# EasyEDA Pro project 重力怀表.epro, schematic Schematic1
Board Name: Board1; Create Date: 2026-02-02; Page Name: P1; Project Name: 重力怀表; Schematic Name: Schematic1; Update Date: 2026-06-20; Company: 嘉立创EDA; Page Size: A4; Version: V1.0
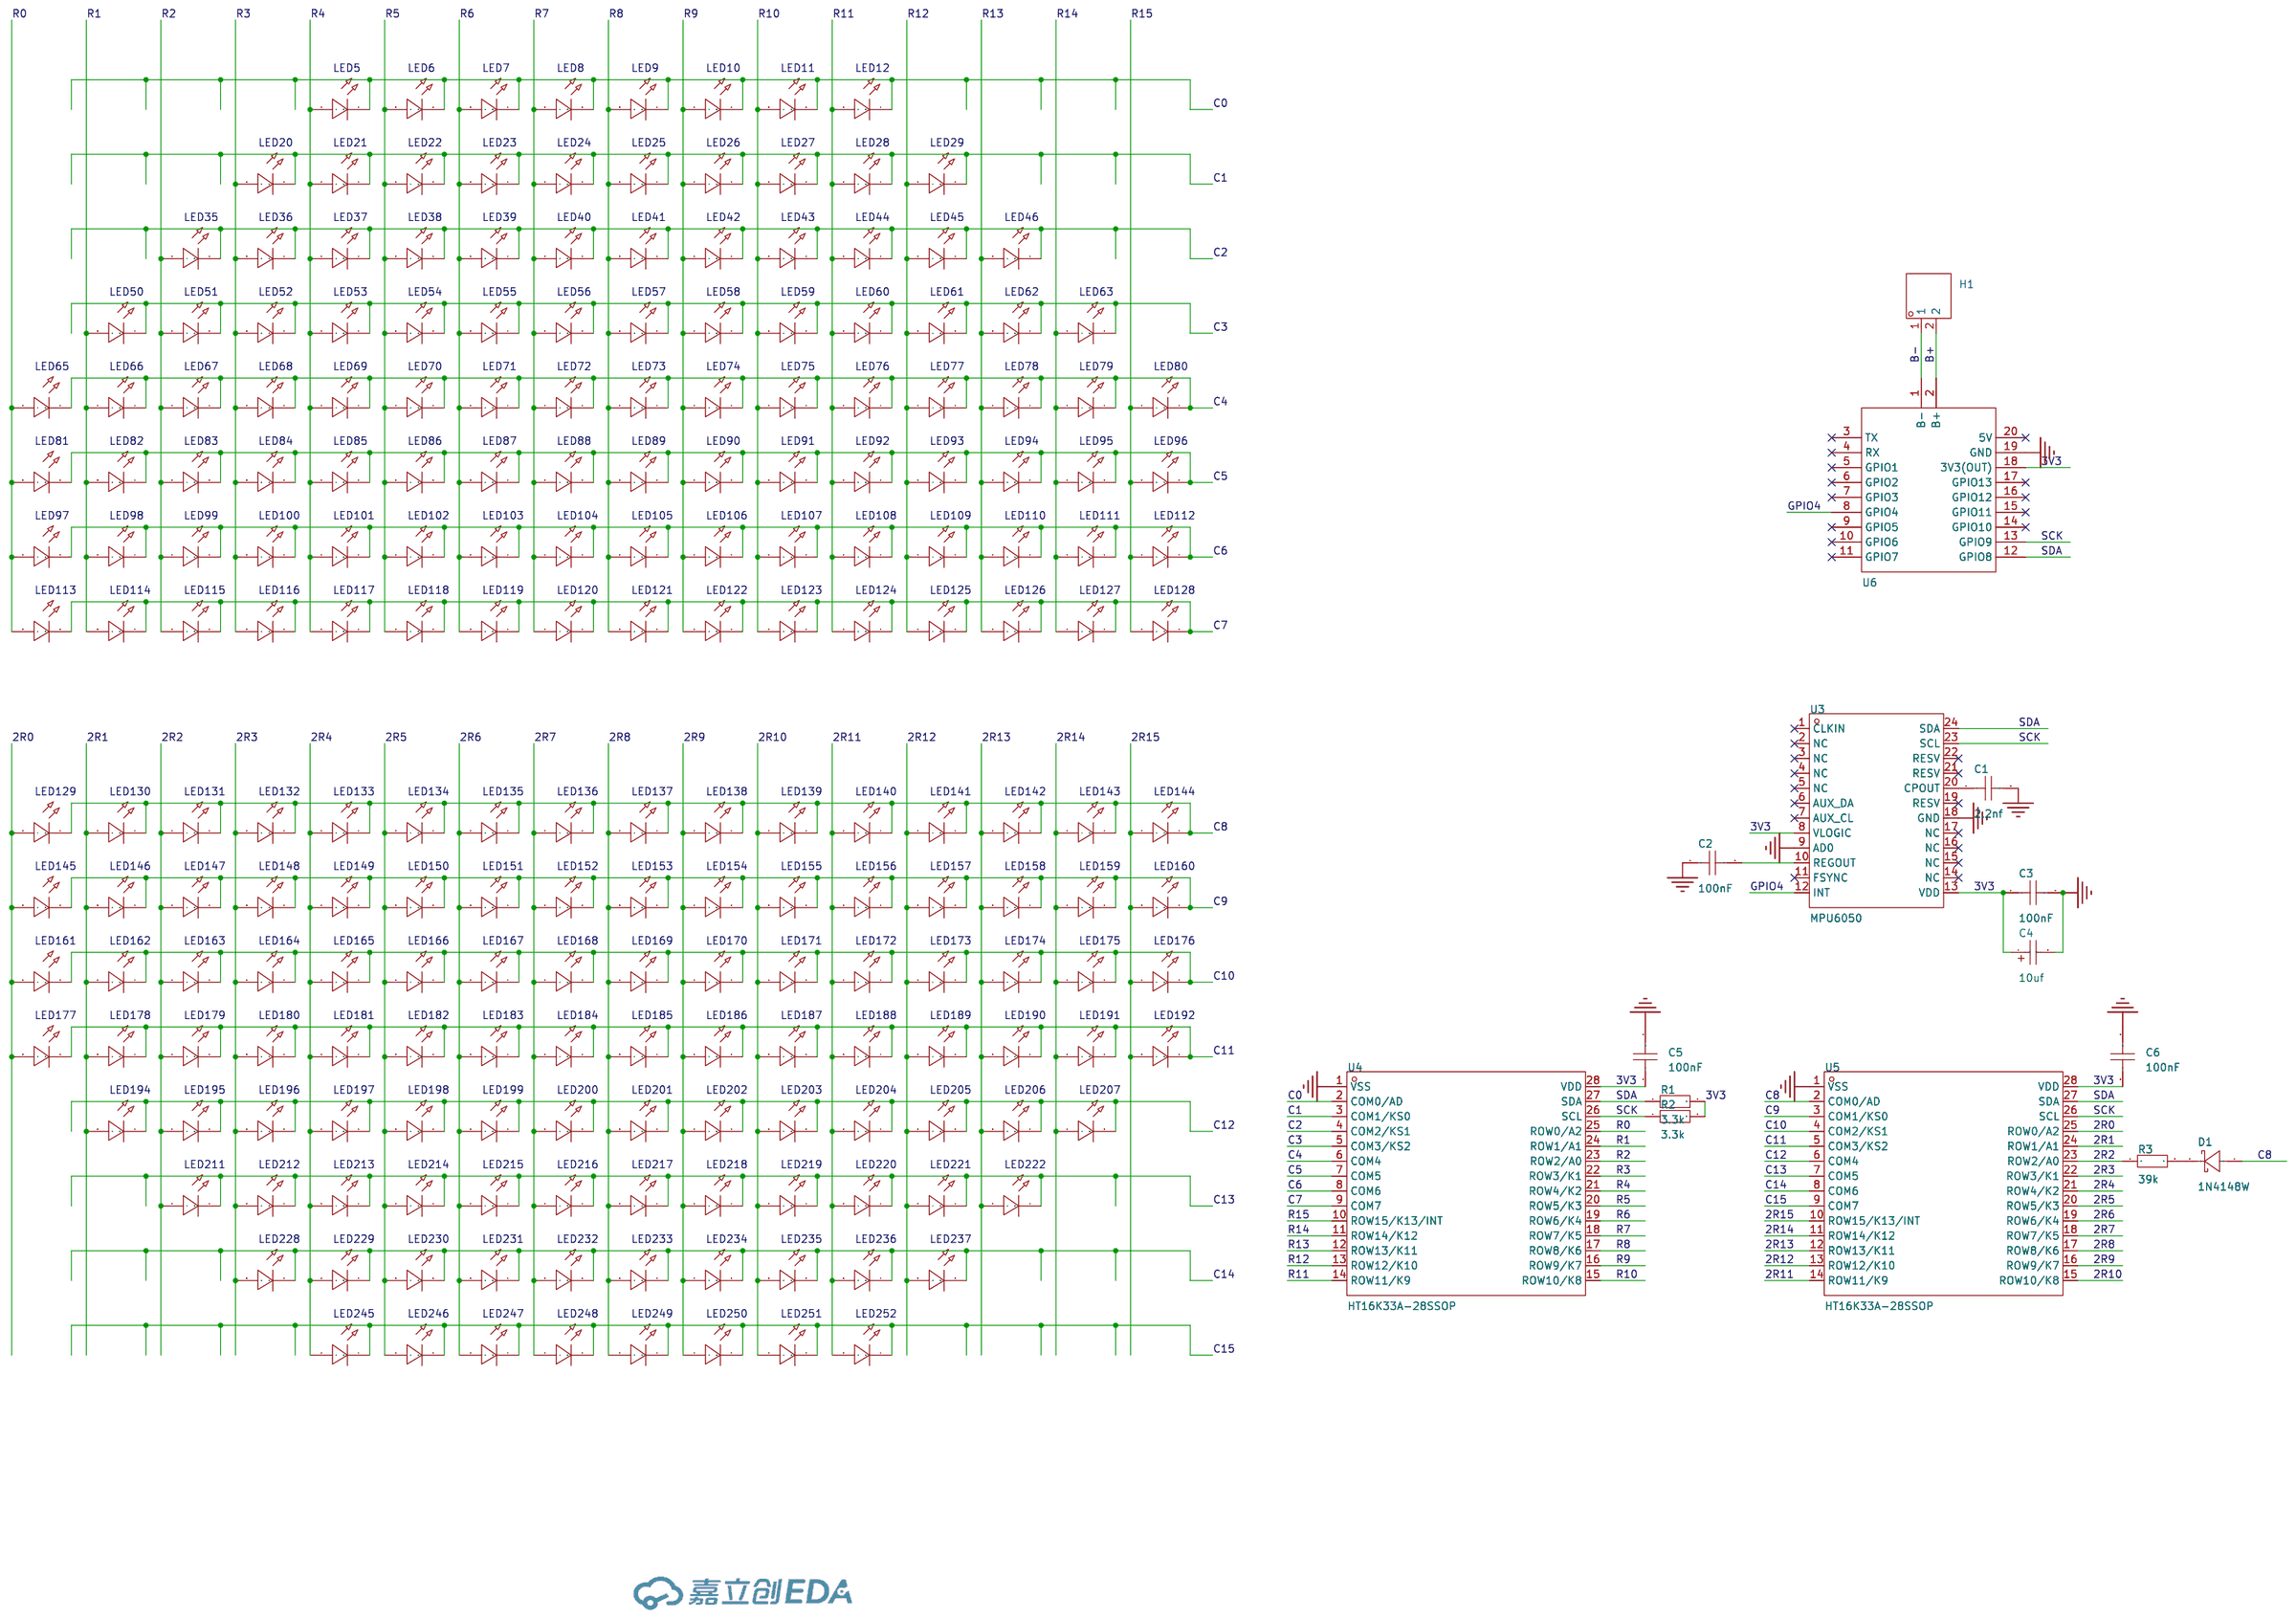
[diagram p0: schematic sheet]

## Parts
C1  2.2nf  [C0603]
C2  100nF  [C0603]
C3  100nF  [C0603]
C4  10uf  [CASE-B_3528]
C5  100nF  [C0603]
C6  100nF  [C0603]
D1  1N4148W  [SOD-123_L2.7-W1.6-LS3.7-FD]
H1  -  [HDR-TH_2P-P2.54-V-M-1]
LED5  -  [LED_0402]
LED6  -  [LED_0402]
LED7  -  [LED_0402]
LED8  -  [LED_0402]
LED9  -  [LED_0402]
LED10  -  [LED_0402]
LED11  -  [LED_0402]
LED12  -  [LED_0402]
LED20  -  [LED_0402]
LED21  -  [LED_0402]
LED22  -  [LED_0402]
LED23  -  [LED_0402]
LED24  -  [LED_0402]
LED25  -  [LED_0402]
LED26  -  [LED_0402]
LED27  -  [LED_0402]
LED28  -  [LED_0402]
LED29  -  [LED_0402]
LED35  -  [LED_0402]
LED36  -  [LED_0402]
LED37  -  [LED_0402]
LED38  -  [LED_0402]
LED39  -  [LED_0402]
LED40  -  [LED_0402]
LED41  -  [LED_0402]
LED42  -  [LED_0402]
LED43  -  [LED_0402]
LED44  -  [LED_0402]
LED45  -  [LED_0402]
LED46  -  [LED_0402]
LED50  -  [LED_0402]
LED51  -  [LED_0402]
LED52  -  [LED_0402]
LED53  -  [LED_0402]
LED54  -  [LED_0402]
LED55  -  [LED_0402]
LED56  -  [LED_0402]
LED57  -  [LED_0402]
LED58  -  [LED_0402]
LED59  -  [LED_0402]
LED60  -  [LED_0402]
LED61  -  [LED_0402]
LED62  -  [LED_0402]
LED63  -  [LED_0402]
LED65  -  [LED_0402]
LED66  -  [LED_0402]
LED67  -  [LED_0402]
LED68  -  [LED_0402]
LED69  -  [LED_0402]
LED70  -  [LED_0402]
LED71  -  [LED_0402]
LED72  -  [LED_0402]
LED73  -  [LED_0402]
LED74  -  [LED_0402]
LED75  -  [LED_0402]
LED76  -  [LED_0402]
LED77  -  [LED_0402]
LED78  -  [LED_0402]
LED79  -  [LED_0402]
LED80  -  [LED_0402]
LED81  -  [LED_0402]
LED82  -  [LED_0402]
LED83  -  [LED_0402]
LED84  -  [LED_0402]
LED85  -  [LED_0402]
LED86  -  [LED_0402]
LED87  -  [LED_0402]
LED88  -  [LED_0402]
LED89  -  [LED_0402]
LED90  -  [LED_0402]
LED91  -  [LED_0402]
LED92  -  [LED_0402]
LED93  -  [LED_0402]
LED94  -  [LED_0402]
LED95  -  [LED_0402]
LED96  -  [LED_0402]
LED97  -  [LED_0402]
LED98  -  [LED_0402]
LED99  -  [LED_0402]
LED100  -  [LED_0402]
LED101  -  [LED_0402]
LED102  -  [LED_0402]
LED103  -  [LED_0402]
LED104  -  [LED_0402]
LED105  -  [LED_0402]
LED106  -  [LED_0402]
LED107  -  [LED_0402]
LED108  -  [LED_0402]
LED109  -  [LED_0402]
LED110  -  [LED_0402]
LED111  -  [LED_0402]
LED112  -  [LED_0402]
LED113  -  [LED_0402]
LED114  -  [LED_0402]
LED115  -  [LED_0402]
LED116  -  [LED_0402]
LED117  -  [LED_0402]
LED118  -  [LED_0402]
LED119  -  [LED_0402]
LED120  -  [LED_0402]
LED121  -  [LED_0402]
LED122  -  [LED_0402]
LED123  -  [LED_0402]
LED124  -  [LED_0402]
LED125  -  [LED_0402]
LED126  -  [LED_0402]
LED127  -  [LED_0402]
LED128  -  [LED_0402]
LED129  -  [LED_0402]
LED130  -  [LED_0402]
LED131  -  [LED_0402]
LED132  -  [LED_0402]
LED133  -  [LED_0402]
LED134  -  [LED_0402]
LED135  -  [LED_0402]
LED136  -  [LED_0402]
LED137  -  [LED_0402]
LED138  -  [LED_0402]
LED139  -  [LED_0402]
LED140  -  [LED_0402]
LED141  -  [LED_0402]
LED142  -  [LED_0402]
LED143  -  [LED_0402]
LED144  -  [LED_0402]
LED145  -  [LED_0402]
LED146  -  [LED_0402]
LED147  -  [LED_0402]
LED148  -  [LED_0402]
LED149  -  [LED_0402]
LED150  -  [LED_0402]
LED151  -  [LED_0402]
LED152  -  [LED_0402]
LED153  -  [LED_0402]
LED154  -  [LED_0402]
LED155  -  [LED_0402]
LED156  -  [LED_0402]
LED157  -  [LED_0402]
LED158  -  [LED_0402]
LED159  -  [LED_0402]
LED160  -  [LED_0402]
LED161  -  [LED_0402]
LED162  -  [LED_0402]
LED163  -  [LED_0402]
LED164  -  [LED_0402]
LED165  -  [LED_0402]
LED166  -  [LED_0402]
LED167  -  [LED_0402]
LED168  -  [LED_0402]
LED169  -  [LED_0402]
LED170  -  [LED_0402]
LED171  -  [LED_0402]
LED172  -  [LED_0402]
LED173  -  [LED_0402]
LED174  -  [LED_0402]
LED175  -  [LED_0402]
LED176  -  [LED_0402]
LED177  -  [LED_0402]
LED178  -  [LED_0402]
LED179  -  [LED_0402]
LED180  -  [LED_0402]
LED181  -  [LED_0402]
LED182  -  [LED_0402]
LED183  -  [LED_0402]
LED184  -  [LED_0402]
LED185  -  [LED_0402]
LED186  -  [LED_0402]
LED187  -  [LED_0402]
LED188  -  [LED_0402]
LED189  -  [LED_0402]
LED190  -  [LED_0402]
LED191  -  [LED_0402]
LED192  -  [LED_0402]
LED194  -  [LED_0402]
LED195  -  [LED_0402]
LED196  -  [LED_0402]
LED197  -  [LED_0402]
LED198  -  [LED_0402]
LED199  -  [LED_0402]
LED200  -  [LED_0402]
LED201  -  [LED_0402]
LED202  -  [LED_0402]
LED203  -  [LED_0402]
LED204  -  [LED_0402]
LED205  -  [LED_0402]
LED206  -  [LED_0402]
LED207  -  [LED_0402]
LED211  -  [LED_0402]
LED212  -  [LED_0402]
LED213  -  [LED_0402]
LED214  -  [LED_0402]
LED215  -  [LED_0402]
LED216  -  [LED_0402]
LED217  -  [LED_0402]
LED218  -  [LED_0402]
LED219  -  [LED_0402]
LED220  -  [LED_0402]
LED221  -  [LED_0402]
LED222  -  [LED_0402]
LED228  -  [LED_0402]
LED229  -  [LED_0402]
LED230  -  [LED_0402]
LED231  -  [LED_0402]
LED232  -  [LED_0402]
LED233  -  [LED_0402]
LED234  -  [LED_0402]
LED235  -  [LED_0402]
LED236  -  [LED_0402]
LED237  -  [LED_0402]
LED245  -  [LED_0402]
LED246  -  [LED_0402]
LED247  -  [LED_0402]
LED248  -  [LED_0402]
LED249  -  [LED_0402]
LED250  -  [LED_0402]
LED251  -  [LED_0402]
LED252  -  [LED_0402]
R1  3.3k  [R0603]
R2  3.3k  [R0603]
R3  39k  [R0603]
U3  MPU6050  [QFN-24_L4.0-W4.0-P0.50-BL]
U4  HT16K33A-28SSOP  [SSOP-28_L9.9-W3.9-P0.64-LS6.0-BL]
U5  HT16K33A-28SSOP  [SSOP-28_L9.9-W3.9-P0.64-LS6.0-BL]
U6  -  [esp32 suoermini s3]

## Library data of the parts
C1-C3 C5 C6 = CAP_0603: Supplier Footprint: 0603
C4 = TAJB107K006RNJ: 容值:100uF;精度:±10%;额定电压:6.3V;等效串联电阻(ESR):1.7Ω@100kHz;; LCSC Part Name: 100uF ±10% 6.3V; Supplier Part: C16133; Manufacturer: Kyocera AVX; Supplier Footprint: CASE-B-3528-21(mm); JLCPCB Part Class: 基础库; Supplier: LCSC; Tolerance: ±10%; Voltage Rating: 6.3V; Equivalent Series Resistance(ESR): 1.7Ω@100kHz; Operating Temperature: -55℃~+125℃
D1 = 1N4148W_C7420318: 二极管配置:独立式;正向压降(Vf):1.25V@150mA;直流反向耐压(Vr):100V;整流电流:150mA;反向恢复时间(Trr):4ns;; LCSC Part Name: 100V 150mA; Supplier Part: C7420318; Manufacturer: R+O(宏嘉诚); Supplier Footprint: SOD-123; JLCPCB Part Class: 扩展库; Datasheet: https://item.szlcsc.com/datasheet/1N4148W/8397140.html; Supplier: LCSC; Diode Configuration: 独立式; Voltage - Forward(Vf@If): 1.25V@150mA; Voltage - DC Reverse(Vr): 100V; Current - Rectified: 150mA; Pd - Power Dissipation: 400mW; Reverse Leakage Current (Ir): 1uA@75V; Reverse Recovery Time (trr): 4ns; Operating Junction Temperature Range: -55℃~+150℃; Non-Repetitive Peak Forward Surge Current: 2A
H1 = HDR-M_2.54_1x2P: Supplier Part: C124375; Supplier Footprint: 插件
LED5-LED12 LED20-LED29 LED35-LED46 LED50-LED63 LED65-LED192 LED194-LED207 LED211-LED222 LED228-LED237 LED245-LED252 = LED_0402-G: Supplier Footprint: 0402
R1-R3 = Res_0603: Supplier Footprint: 0603
U3 = MPU6050: Supplier Part: C9900042518; Supplier Footprint: QFN-24_L4.0-W4.0-P0.50-BL-EP2.7; Supplier: LCSC
U4 U5 = HT16K33A-28SSOP: Supplier Part: C5444738; Manufacturer: HOLTEK(合泰/盛群); Supplier Footprint: SSOP-28; JLCPCB Part Class: 扩展库; Datasheet: https://atta.szlcsc.com/upload/public/pdf/source/20230511/B2CD5F3AD41502590BB636DD50A0336A.pdf; Supplier: LCSC
U6 = esp32 supermini s3

## Nets
3V3: C3.1 C4.1 C5.1 C6.1 R1.2 R2.2 U3.8(VLOGIC) U3.13(VDD) U4.28(VDD) U5.28(VDD) U6.18(3V3(OUT))
GND: C1.2 C2.1 C3.2 C4.2 C5.2 C6.2 U3.9(AD0) U3.18(GND) U4.1(VSS) U5.1(VSS) U6.19(GND)
2R0: LED129.2(A) LED145.2(A) LED161.2(A) LED177.2(A) U5.25(ROW0/A2)
2R1: LED130.2(A) LED146.2(A) LED162.2(A) LED178.2(A) LED194.2(A) U5.24(ROW1/A1)
2R2: LED131.2(A) LED147.2(A) LED163.2(A) LED179.2(A) LED195.2(A) LED211.2(A) R3.1 U5.23(ROW2/A0)
2R3: LED132.2(A) LED148.2(A) LED164.2(A) LED180.2(A) LED196.2(A) LED212.2(A) LED228.2(A) U5.22(ROW3/K1)
2R4: LED133.2(A) LED149.2(A) LED165.2(A) LED181.2(A) LED197.2(A) LED213.2(A) LED229.2(A) LED245.2(A) U5.21(ROW4/K2)
2R5: LED134.2(A) LED150.2(A) LED166.2(A) LED182.2(A) LED198.2(A) LED214.2(A) LED230.2(A) LED246.2(A) U5.20(ROW5/K3)
2R6: LED135.2(A) LED151.2(A) LED167.2(A) LED183.2(A) LED199.2(A) LED215.2(A) LED231.2(A) LED247.2(A) U5.19(ROW6/K4)
2R7: LED136.2(A) LED152.2(A) LED168.2(A) LED184.2(A) LED200.2(A) LED216.2(A) LED232.2(A) LED248.2(A) U5.18(ROW7/K5)
2R8: LED137.2(A) LED153.2(A) LED169.2(A) LED185.2(A) LED201.2(A) LED217.2(A) LED233.2(A) LED249.2(A) U5.17(ROW8/K6)
2R9: LED138.2(A) LED154.2(A) LED170.2(A) LED186.2(A) LED202.2(A) LED218.2(A) LED234.2(A) LED250.2(A) U5.16(ROW9/K7)
2R10: LED139.2(A) LED155.2(A) LED171.2(A) LED187.2(A) LED203.2(A) LED219.2(A) LED235.2(A) LED251.2(A) U5.15(ROW10/K8)
2R11: LED140.2(A) LED156.2(A) LED172.2(A) LED188.2(A) LED204.2(A) LED220.2(A) LED236.2(A) LED252.2(A) U5.14(ROW11/K9)
2R12: LED141.2(A) LED157.2(A) LED173.2(A) LED189.2(A) LED205.2(A) LED221.2(A) LED237.2(A) U5.13(ROW12/K10)
2R13: LED142.2(A) LED158.2(A) LED174.2(A) LED190.2(A) LED206.2(A) LED222.2(A) U5.12(ROW13/K11)
2R14: LED143.2(A) LED159.2(A) LED175.2(A) LED191.2(A) LED207.2(A) U5.11(ROW14/K12)
2R15: LED144.2(A) LED160.2(A) LED176.2(A) LED192.2(A) U5.10(ROW15/K13/INT)
B+: H1.2 U6.2(B+)
B-: H1.1 U6.1(B-)
C0: LED5.1(C) LED6.1(C) LED7.1(C) LED8.1(C) LED9.1(C) LED10.1(C) LED11.1(C) LED12.1(C) U4.2(COM0/AD)
C1: LED20.1(C) LED21.1(C) LED22.1(C) LED23.1(C) LED24.1(C) LED25.1(C) LED26.1(C) LED27.1(C) LED28.1(C) LED29.1(C) U4.3(COM1/KS0)
C2: LED35.1(C) LED36.1(C) LED37.1(C) LED38.1(C) LED39.1(C) LED40.1(C) LED41.1(C) LED42.1(C) LED43.1(C) LED44.1(C) LED45.1(C) LED46.1(C) U4.4(COM2/KS1)
C3: LED50.1(C) LED51.1(C) LED52.1(C) LED53.1(C) LED54.1(C) LED55.1(C) LED56.1(C) LED57.1(C) LED58.1(C) LED59.1(C) LED60.1(C) LED61.1(C) LED62.1(C) LED63.1(C) U4.5(COM3/KS2)
C4: LED65.1(C) LED66.1(C) LED67.1(C) LED68.1(C) LED69.1(C) LED70.1(C) LED71.1(C) LED72.1(C) LED73.1(C) LED74.1(C) LED75.1(C) LED76.1(C) LED77.1(C) LED78.1(C) LED79.1(C) LED80.1(C) U4.6(COM4)
C5: LED81.1(C) LED82.1(C) LED83.1(C) LED84.1(C) LED85.1(C) LED86.1(C) LED87.1(C) LED88.1(C) LED89.1(C) LED90.1(C) LED91.1(C) LED92.1(C) LED93.1(C) LED94.1(C) LED95.1(C) LED96.1(C) U4.7(COM5)
C6: LED97.1(C) LED98.1(C) LED99.1(C) LED100.1(C) LED101.1(C) LED102.1(C) LED103.1(C) LED104.1(C) LED105.1(C) LED106.1(C) LED107.1(C) LED108.1(C) LED109.1(C) LED110.1(C) LED111.1(C) LED112.1(C) U4.8(COM6)
C7: LED113.1(C) LED114.1(C) LED115.1(C) LED116.1(C) LED117.1(C) LED118.1(C) LED119.1(C) LED120.1(C) LED121.1(C) LED122.1(C) LED123.1(C) LED124.1(C) LED125.1(C) LED126.1(C) LED127.1(C) LED128.1(C) U4.9(COM7)
C8: D1.1(A) LED129.1(C) LED130.1(C) LED131.1(C) LED132.1(C) LED133.1(C) LED134.1(C) LED135.1(C) LED136.1(C) LED137.1(C) LED138.1(C) LED139.1(C) LED140.1(C) LED141.1(C) LED142.1(C) LED143.1(C) LED144.1(C) U5.2(COM0/AD)
C9: LED145.1(C) LED146.1(C) LED147.1(C) LED148.1(C) LED149.1(C) LED150.1(C) LED151.1(C) LED152.1(C) LED153.1(C) LED154.1(C) LED155.1(C) LED156.1(C) LED157.1(C) LED158.1(C) LED159.1(C) LED160.1(C) U5.3(COM1/KS0)
C10: LED161.1(C) LED162.1(C) LED163.1(C) LED164.1(C) LED165.1(C) LED166.1(C) LED167.1(C) LED168.1(C) LED169.1(C) LED170.1(C) LED171.1(C) LED172.1(C) LED173.1(C) LED174.1(C) LED175.1(C) LED176.1(C) U5.4(COM2/KS1)
C11: LED177.1(C) LED178.1(C) LED179.1(C) LED180.1(C) LED181.1(C) LED182.1(C) LED183.1(C) LED184.1(C) LED185.1(C) LED186.1(C) LED187.1(C) LED188.1(C) LED189.1(C) LED190.1(C) LED191.1(C) LED192.1(C) U5.5(COM3/KS2)
C12: LED194.1(C) LED195.1(C) LED196.1(C) LED197.1(C) LED198.1(C) LED199.1(C) LED200.1(C) LED201.1(C) LED202.1(C) LED203.1(C) LED204.1(C) LED205.1(C) LED206.1(C) LED207.1(C) U5.6(COM4)
C13: LED211.1(C) LED212.1(C) LED213.1(C) LED214.1(C) LED215.1(C) LED216.1(C) LED217.1(C) LED218.1(C) LED219.1(C) LED220.1(C) LED221.1(C) LED222.1(C) U5.7(COM5)
C14: LED228.1(C) LED229.1(C) LED230.1(C) LED231.1(C) LED232.1(C) LED233.1(C) LED234.1(C) LED235.1(C) LED236.1(C) LED237.1(C) U5.8(COM6)
C15: LED245.1(C) LED246.1(C) LED247.1(C) LED248.1(C) LED249.1(C) LED250.1(C) LED251.1(C) LED252.1(C) U5.9(COM7)
GPIO4: U3.12(INT) U6.8(GPIO4)
R0: LED65.2(A) LED81.2(A) LED97.2(A) LED113.2(A) U4.25(ROW0/A2)
R1: LED50.2(A) LED66.2(A) LED82.2(A) LED98.2(A) LED114.2(A) U4.24(ROW1/A1)
R2: LED35.2(A) LED51.2(A) LED67.2(A) LED83.2(A) LED99.2(A) LED115.2(A) U4.23(ROW2/A0)
R3: LED20.2(A) LED36.2(A) LED52.2(A) LED68.2(A) LED84.2(A) LED100.2(A) LED116.2(A) U4.22(ROW3/K1)
R4: LED5.2(A) LED21.2(A) LED37.2(A) LED53.2(A) LED69.2(A) LED85.2(A) LED101.2(A) LED117.2(A) U4.21(ROW4/K2)
R5: LED6.2(A) LED22.2(A) LED38.2(A) LED54.2(A) LED70.2(A) LED86.2(A) LED102.2(A) LED118.2(A) U4.20(ROW5/K3)
R6: LED7.2(A) LED23.2(A) LED39.2(A) LED55.2(A) LED71.2(A) LED87.2(A) LED103.2(A) LED119.2(A) U4.19(ROW6/K4)
R7: LED8.2(A) LED24.2(A) LED40.2(A) LED56.2(A) LED72.2(A) LED88.2(A) LED104.2(A) LED120.2(A) U4.18(ROW7/K5)
R8: LED9.2(A) LED25.2(A) LED41.2(A) LED57.2(A) LED73.2(A) LED89.2(A) LED105.2(A) LED121.2(A) U4.17(ROW8/K6)
R9: LED10.2(A) LED26.2(A) LED42.2(A) LED58.2(A) LED74.2(A) LED90.2(A) LED106.2(A) LED122.2(A) U4.16(ROW9/K7)
R10: LED11.2(A) LED27.2(A) LED43.2(A) LED59.2(A) LED75.2(A) LED91.2(A) LED107.2(A) LED123.2(A) U4.15(ROW10/K8)
R11: LED12.2(A) LED28.2(A) LED44.2(A) LED60.2(A) LED76.2(A) LED92.2(A) LED108.2(A) LED124.2(A) U4.14(ROW11/K9)
R12: LED29.2(A) LED45.2(A) LED61.2(A) LED77.2(A) LED93.2(A) LED109.2(A) LED125.2(A) U4.13(ROW12/K10)
R13: LED46.2(A) LED62.2(A) LED78.2(A) LED94.2(A) LED110.2(A) LED126.2(A) U4.12(ROW13/K11)
R14: LED63.2(A) LED79.2(A) LED95.2(A) LED111.2(A) LED127.2(A) U4.11(ROW14/K12)
R15: LED80.2(A) LED96.2(A) LED112.2(A) LED128.2(A) U4.10(ROW15/K13/INT)
SCK: R2.1 U3.23(SCL) U4.26(SCL) U5.26(SCL) U6.13(GPIO9)
SDA: R1.1 U3.24(SDA) U4.27(SDA) U5.27(SDA) U6.12(GPIO8)
$1N45682: D1.2(K) R3.2
$1N54662: C2.2 U3.10(REGOUT)
$1N54743: C1.1 U3.20(CPOUT)

Not connected (* = marked no-connect by the designer): U3 1(CLKIN)* 2(NC)* 3(NC)* 4(NC)* 5(NC)* 6(AUX_DA)* 7(AUX_CL)* 11(FSYNC)* 14(NC)* 15(NC)* 16(NC)* 17(NC)* 19(RESV)* 21(RESV)* 22(RESV)*; U6 3(TX)* 4(RX)* 5(GPIO1)* 6(GPIO2)* 7(GPIO3)* 9(GPIO5)* 10(GPIO6)* 11(GPIO7)* 14(GPIO10)* 15(GPIO11)* 16(GPIO12)* 17(GPIO13)* 20(5V)*
